# Altium schematic sheet PLC-无线通讯版-检测板-V1.SchDoc
size A0
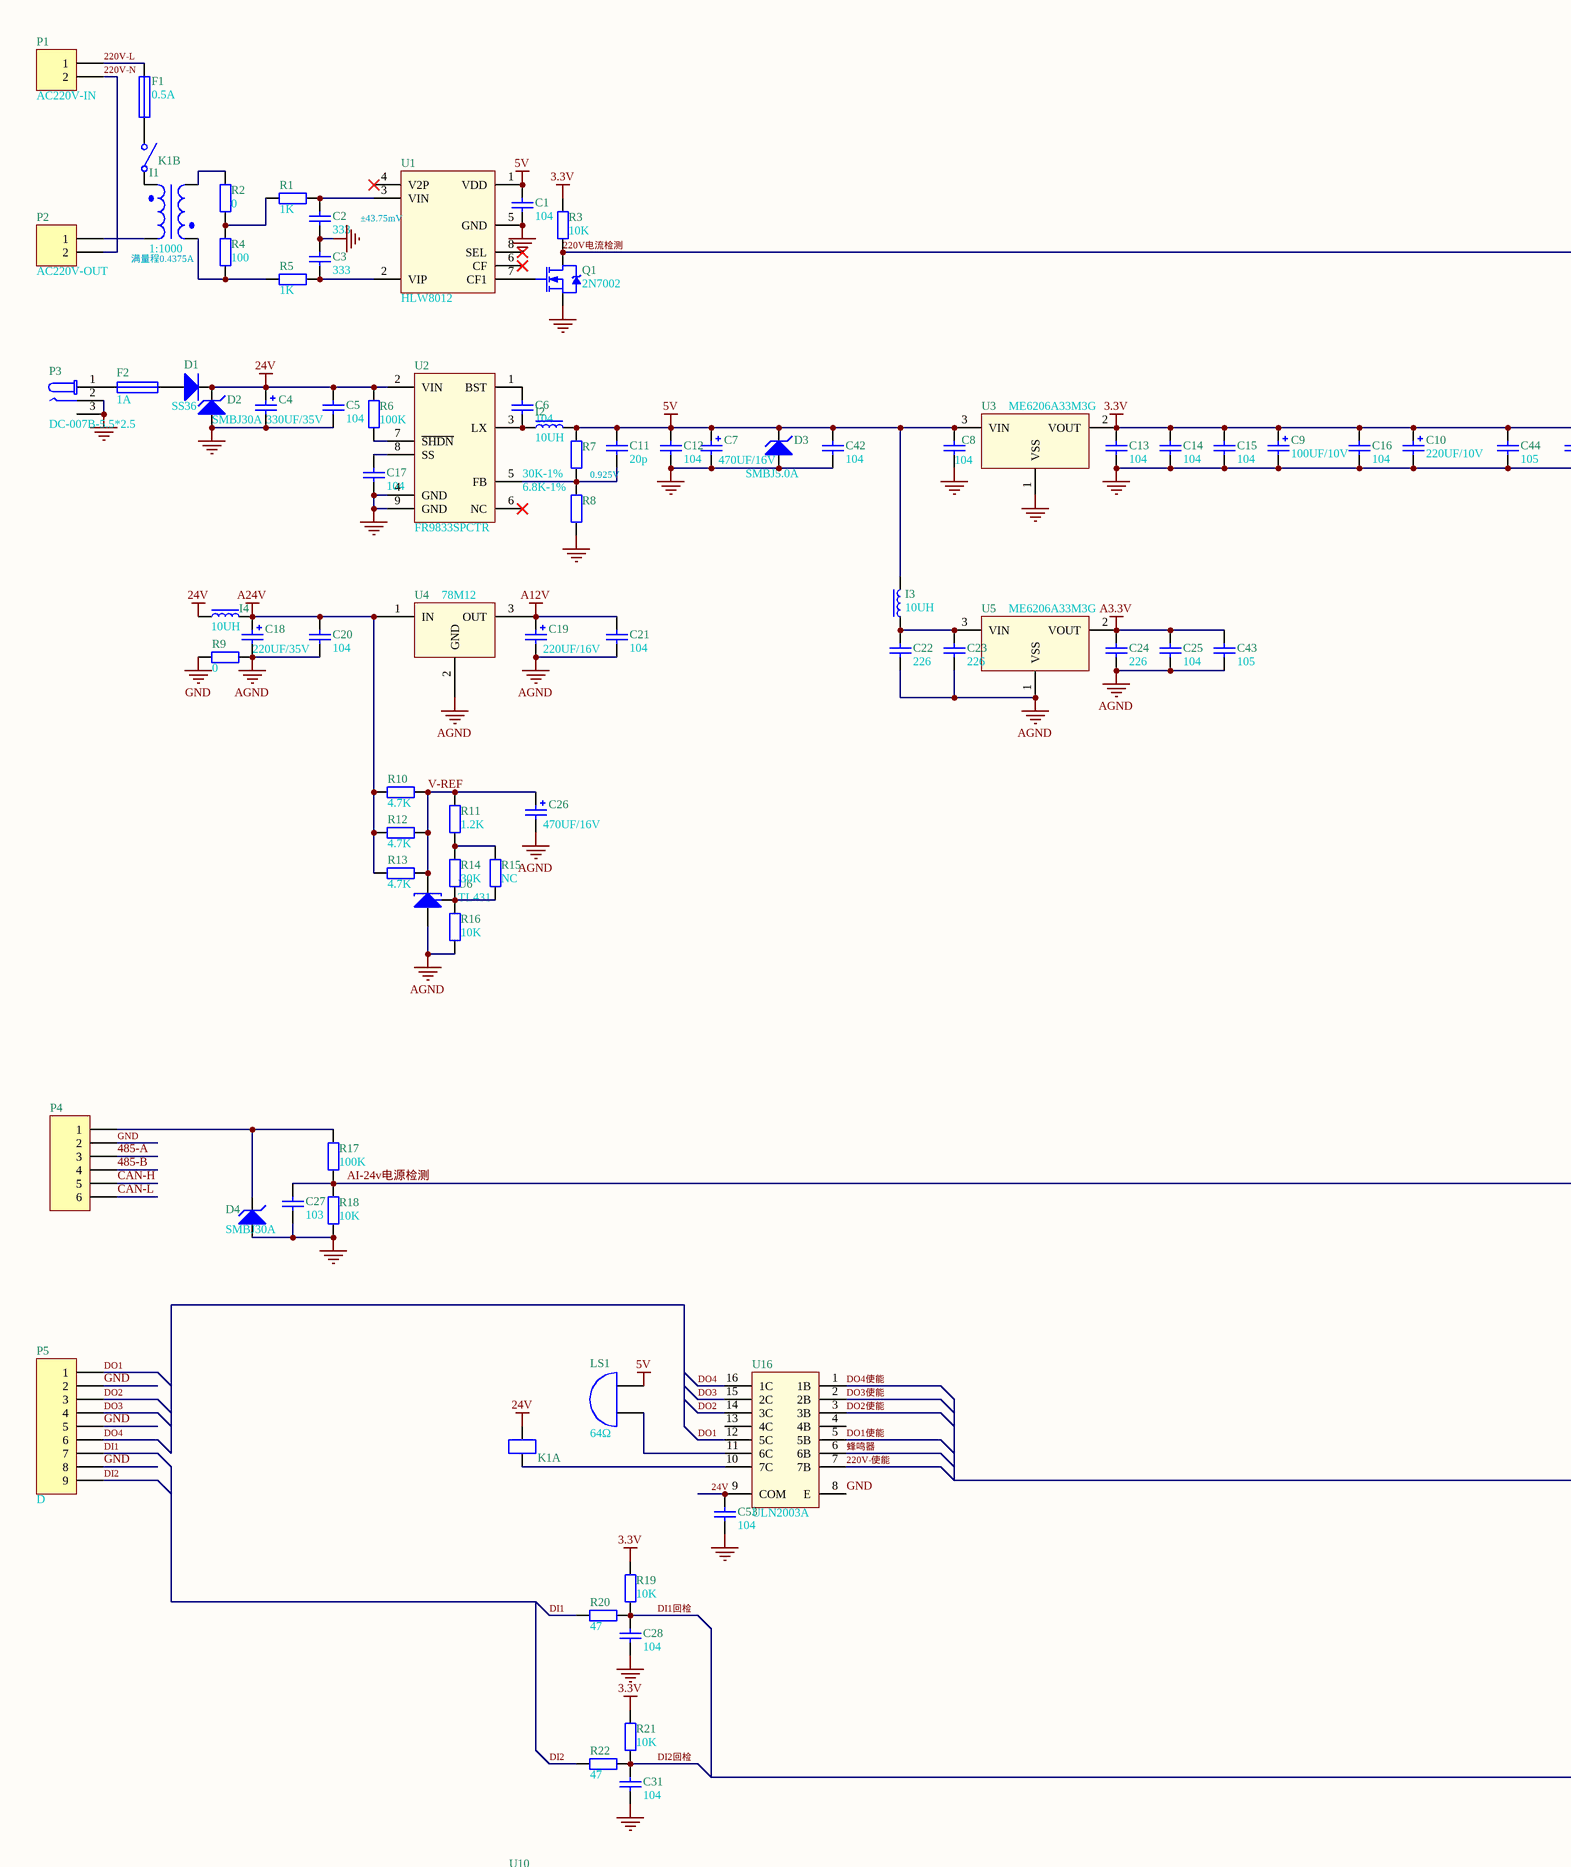
[diagram p0: PLC-无线通讯版-检测板-V1.SchDoc, top left]
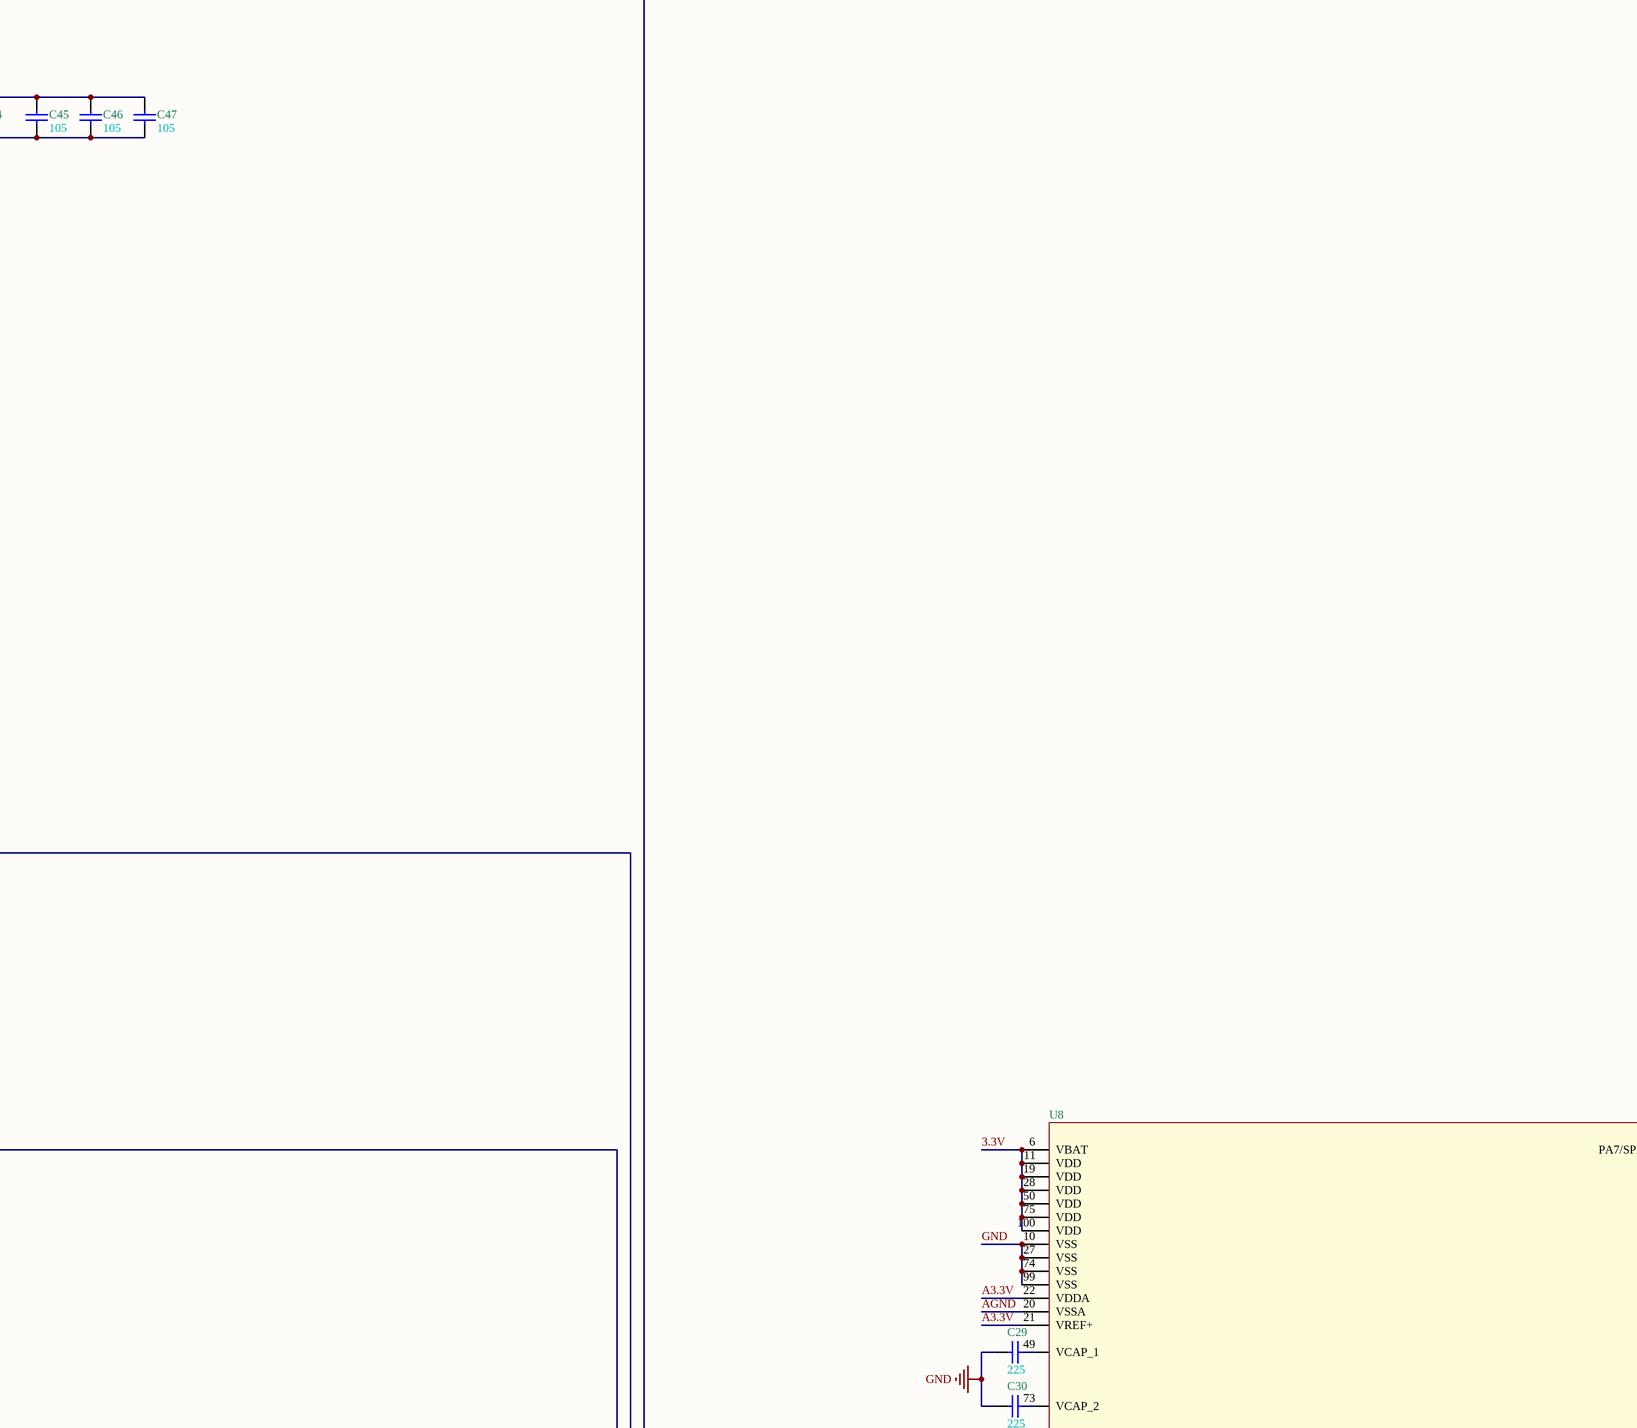
[diagram p1: PLC-无线通讯版-检测板-V1.SchDoc, top middle]
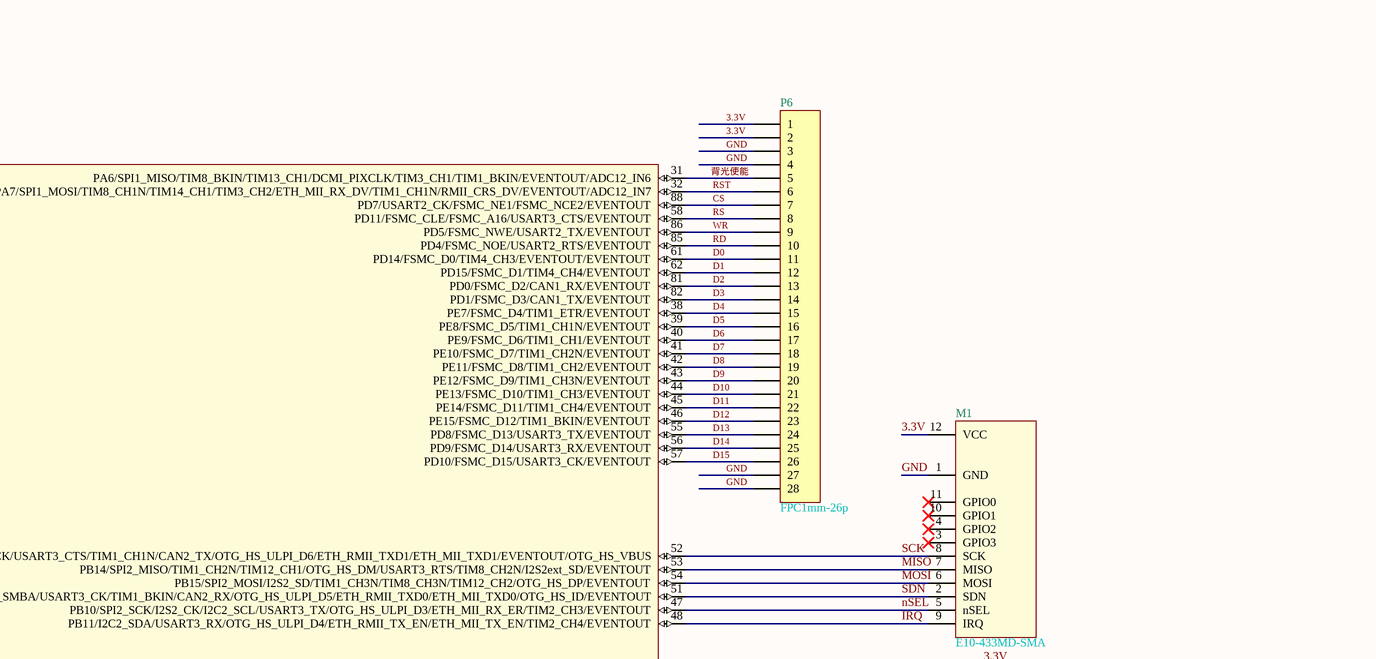
[diagram p2: PLC-无线通讯版-检测板-V1.SchDoc, top right]
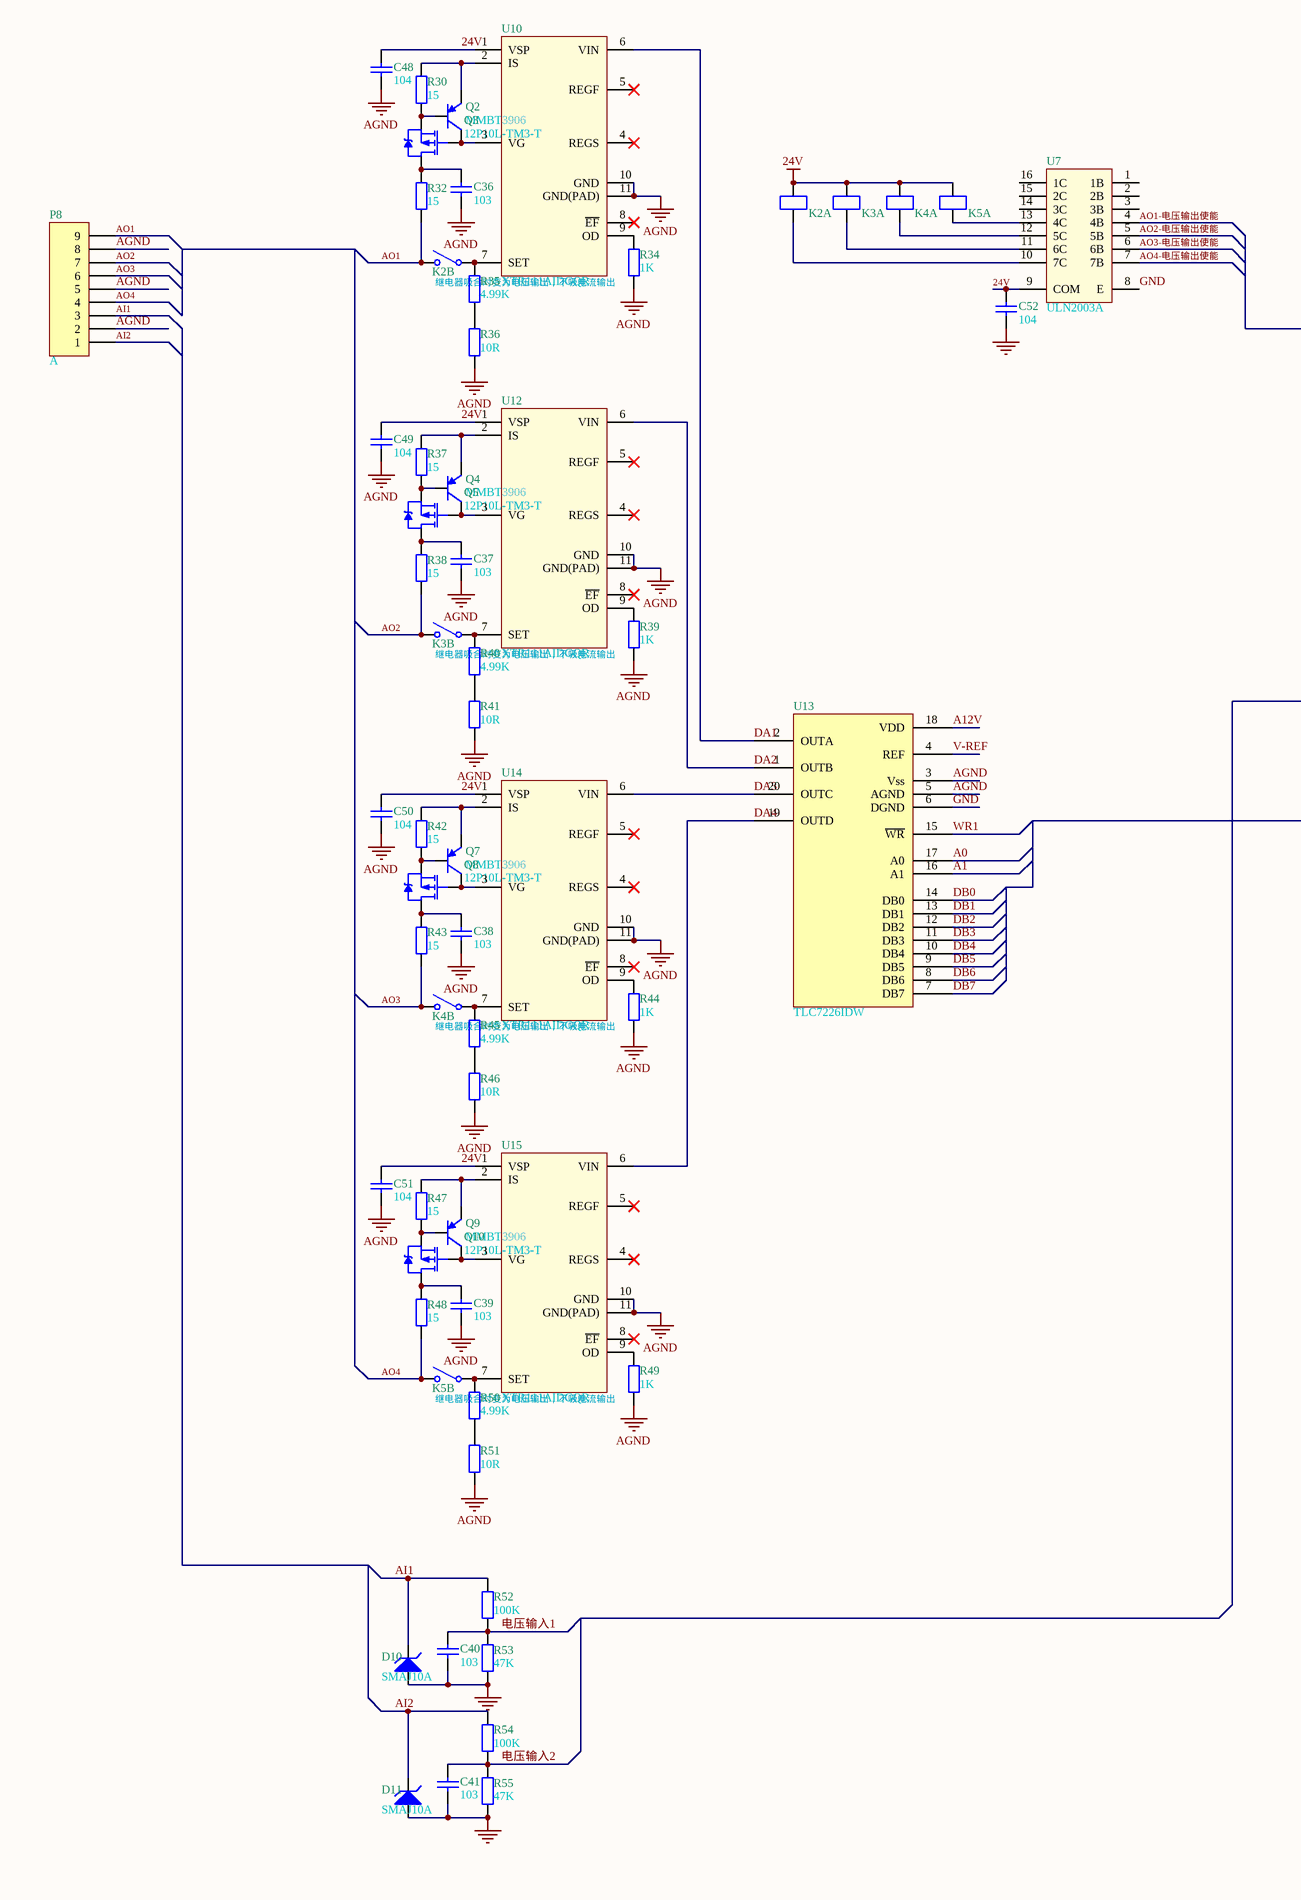
[diagram p3: PLC-无线通讯版-检测板-V1.SchDoc, bottom left]
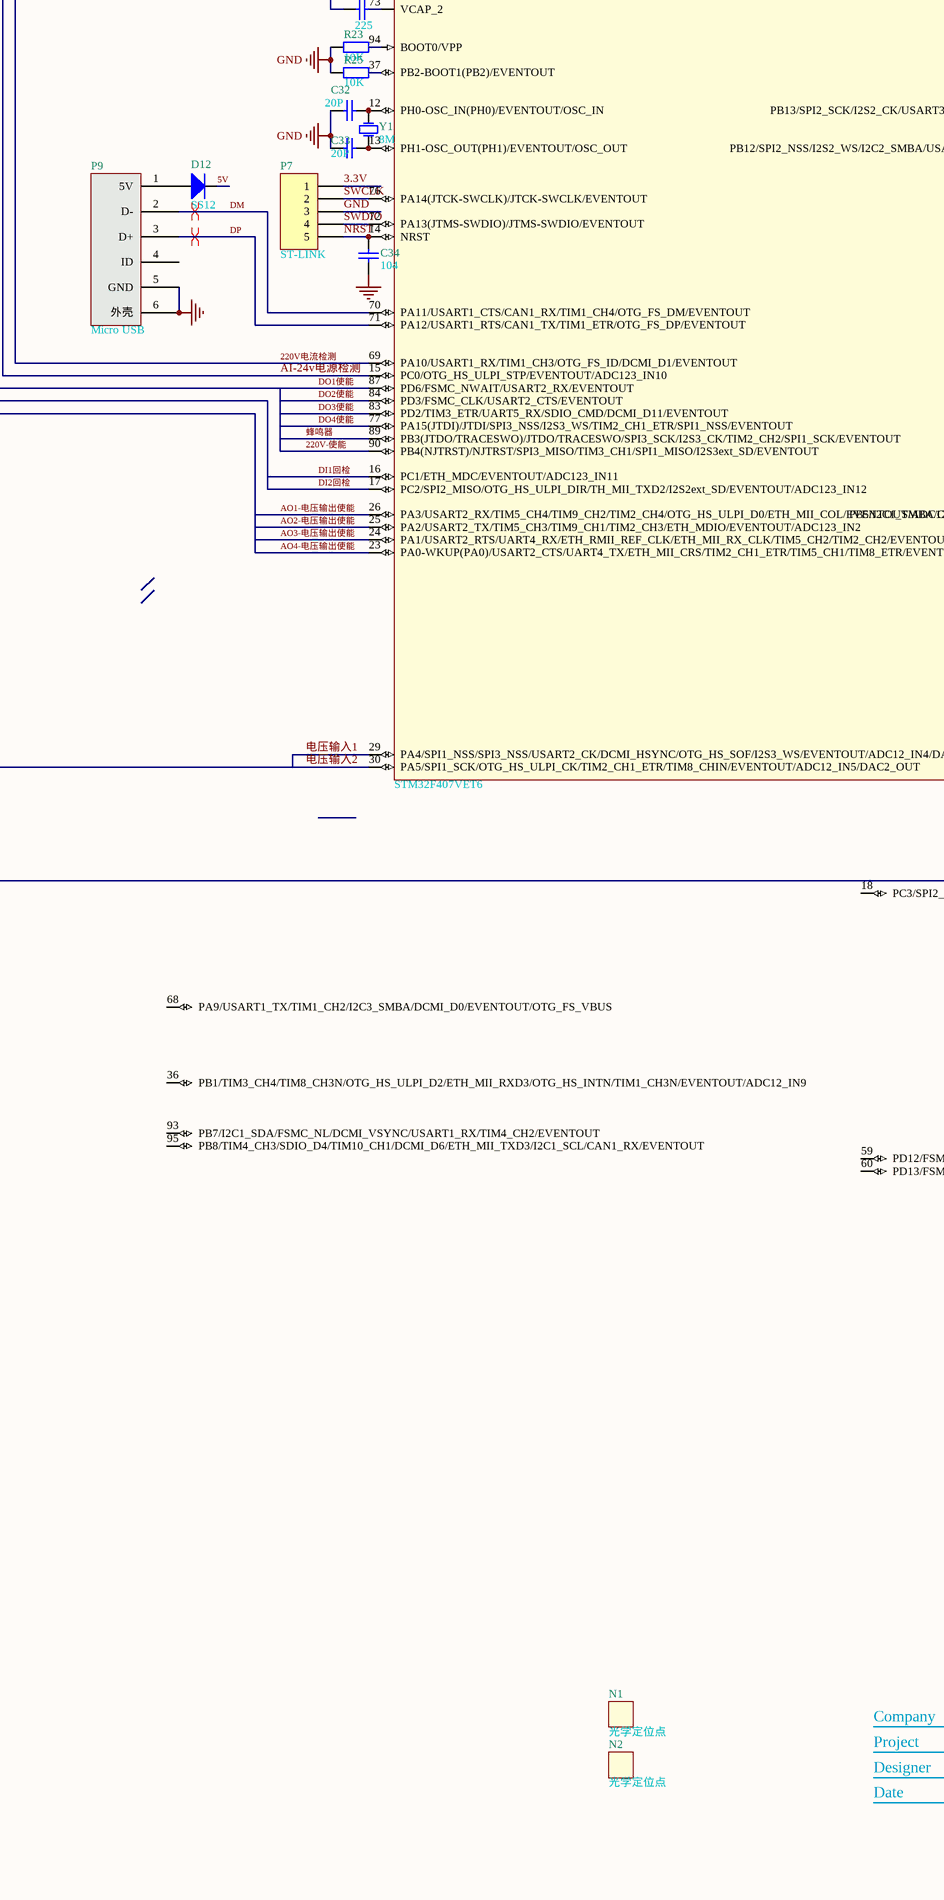
[diagram p4: PLC-无线通讯版-检测板-V1.SchDoc, bottom middle]
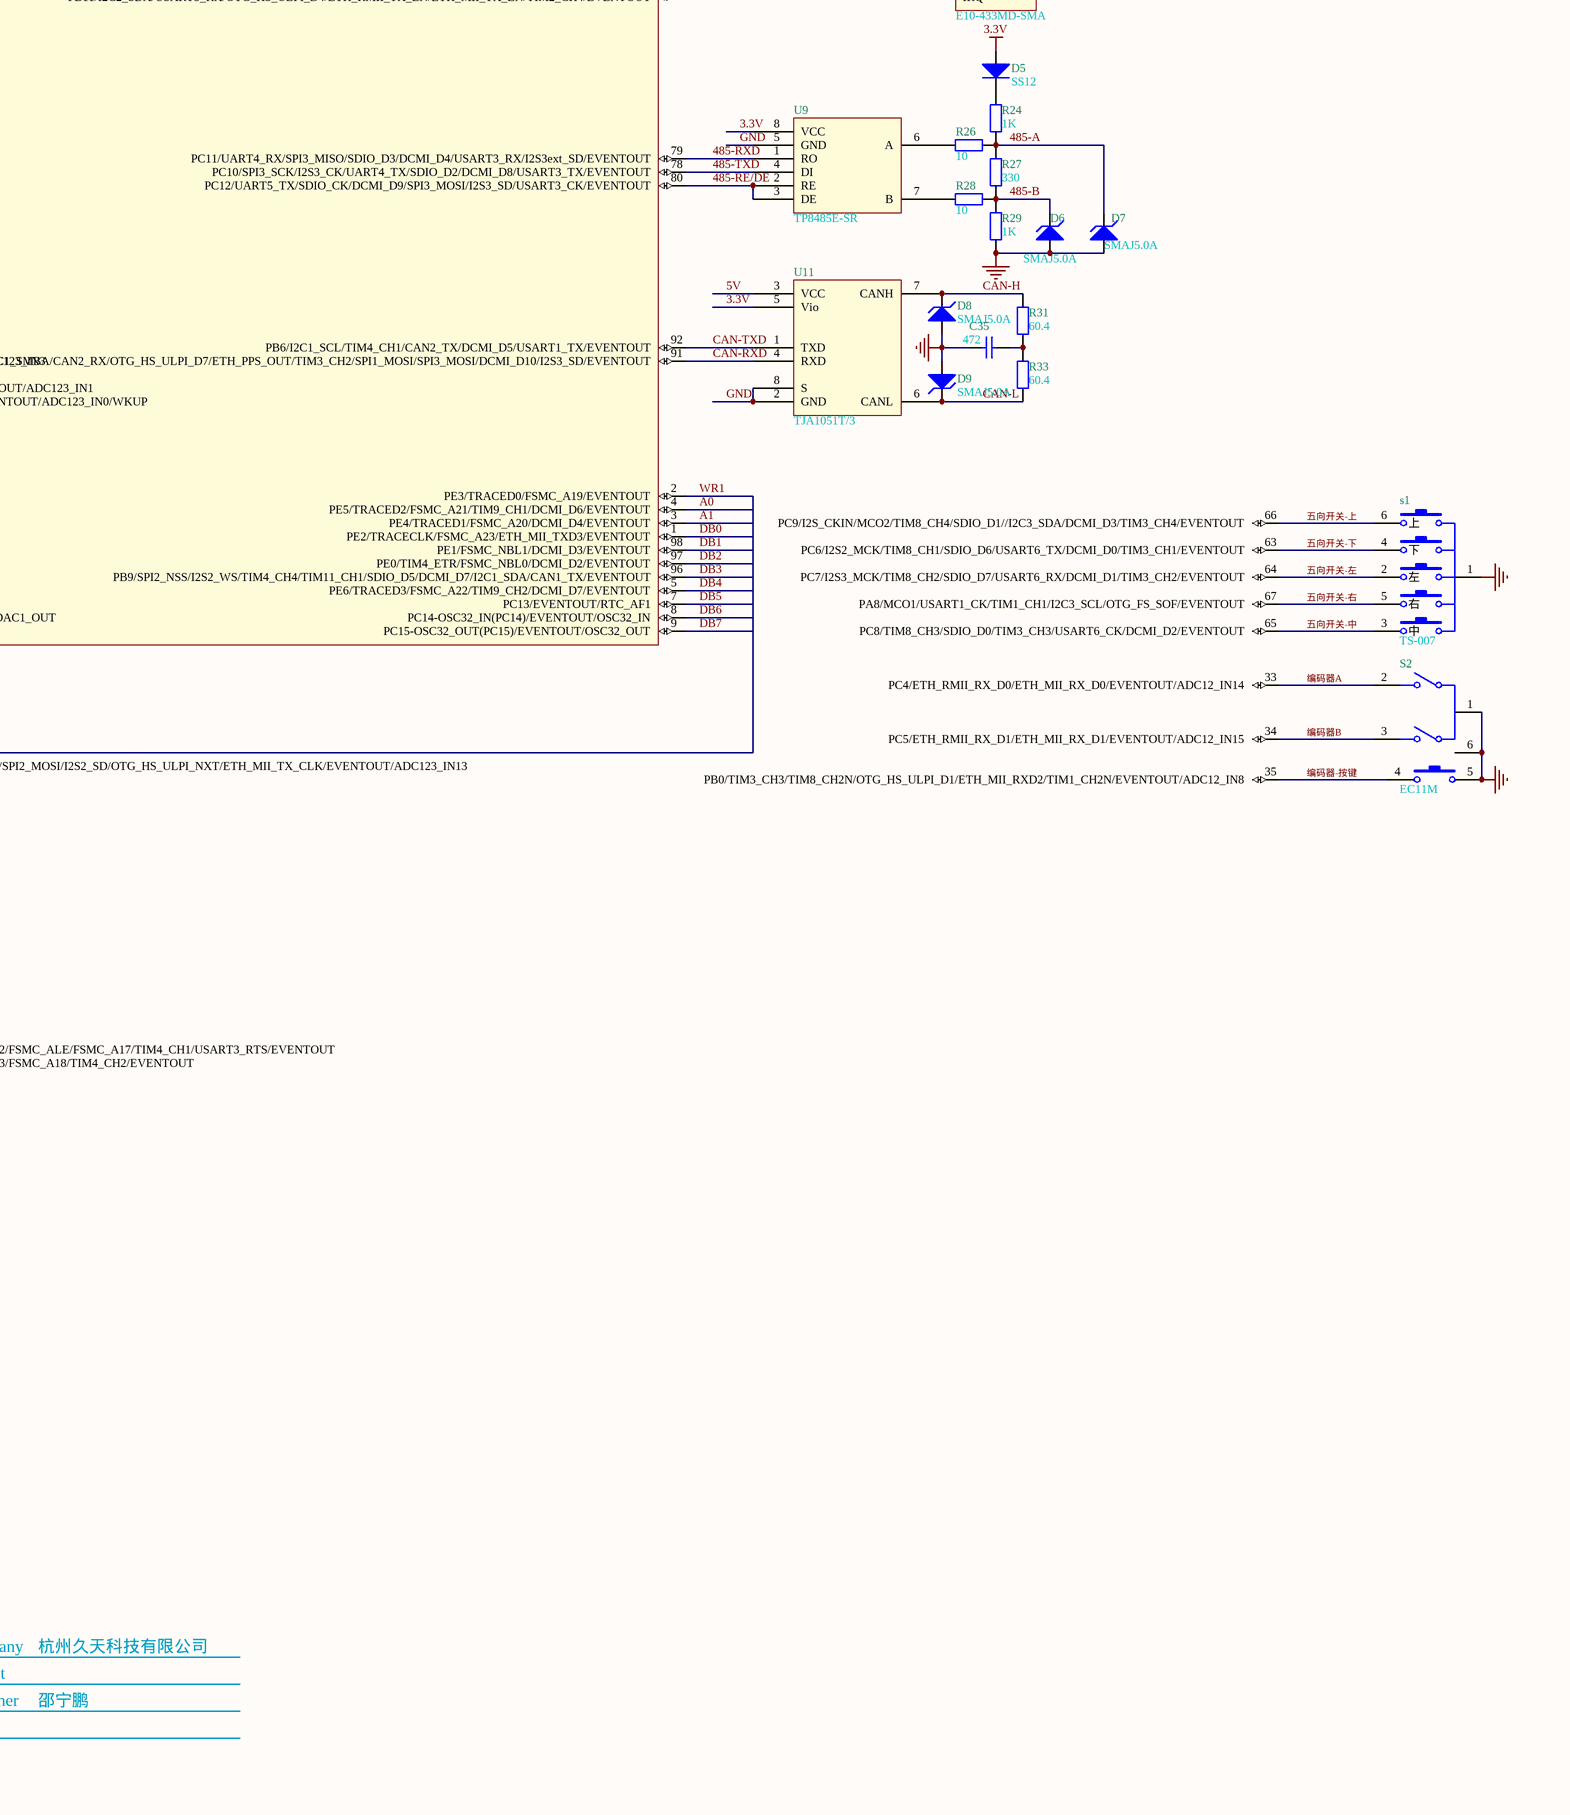
[diagram p5: PLC-无线通讯版-检测板-V1.SchDoc, bottom right]

## Parts
C1  104  [C-0603]
C2  333  [C-0603]
C3  333  [C-0603]
C4  330UF/35V  [贴片固态电容8*10-M]
C5  104  [C-0603]
C6  104  [C-0603]
C7  470UF/16V  [贴片固态电容8*10-M]
C8  104  [C-0603]
C9  100UF/10V  [贴片固态电容5*5.3]
C10  220UF/10V  [贴片固态电容6.3*5.3-M]
C11  20p  [C-0603]
C12  104  [C-0603]
C13  104  [C-0603]
C14  104  [C-0603]
C15  104  [C-0603]
C16  104  [C-0603]
C17  104  [C-0603]
C18  220UF/35V  [贴片固态电容8*10-M]
C19  220UF/16V  [贴片固态电容6.3*7.7]
C20  104  [C-0603]
C21  104  [C-0603]
C22  226  [C-0805]
C23  226  [C-0805]
C24  226  [C-0805]
C25  104  [C-0603]
C26  470UF/16V  [贴片固态电容8*10-M]
C27  103  [C-0603]
C28  104  [C-0603]
C29  225  [C-0603]
C30  225  [C-0603]
C31  104  [C-0603]
C32  20P  [C-0603]
C33  20P  [C-0603]
C34  104  [C-0603]
C35  472  [C-0603]
C36  103  [C-0603]
C37  103  [C-0603]
C38  103  [C-0603]
C39  103  [C-0603]
C40  103  [C-0603]
C41  103  [C-0603]
C42  104  [C-0603]
C43  105  [C-0603]
C44  105  [C-0603]
C45  105  [C-0603]
C46  105  [C-0603]
C47  105  [C-0603]
C48  104  [C-0603]
C49  104  [C-0603]
C50  104  [C-0603]
C51  104  [C-0603]
C52  104  [C-0603]
C53  104  [C-0603]
D1  SS36  [SMB]
D2  SMBJ30A  [SMB-N]
D3  SMBJ5.0A  [SMB-N]
D4  SMBJ30A  [SMB]
D5  SS12  [SOD-523/0603]
D6  SMAJ5.0A  [SMA]
D7  SMAJ5.0A  [SMA]
D8  SMAJ5.0A  [SMA]
D9  SMAJ5.0A  [SMA]
D10  SMAJ10A  [SMA]
D11  SMAJ10A  [SMA]
D12  SS12  [SMA]
F1  0.5A  [FUSE-3*10带引线]
F2  1A  [FUSE-1808保险丝座]
I1  1:1000  [EI19*6.5电流互感器]
I2  10UH  [一体成型电感0630]
I3  10UH  [SWPA4030S]
I4  10UH  [SWPA4030S]
K1  HF49FD-D24-1H11  [HF49FD-D24-1H11]  (value not drawn)  (parts A,B of 2)
K2  HF49FD-D24-1H11  [HF49FD-D24-1H11]  (value not drawn)  (parts A,B of 2)
K3  HF49FD-D24-1H11  [HF49FD-D24-1H11]  (value not drawn)  (parts A,B of 2)
K4  HF49FD-D24-1H11  [HF49FD-D24-1H11]  (value not drawn)  (parts A,B of 2)
K5  HF49FD-D24-1H11  [HF49FD-D24-1H11]  (value not drawn)  (parts A,B of 2)
LS1  64Ω  [蜂鸣器 无源 12*8.2]
M1  E10-433MD-SMA  [E10-433MD-SMA]
N1  光学定位点  [MARK-1mm-3mm]
N2  光学定位点  [MARK-1mm-3mm]
P1  AC220V-IN  [KF2EDGVC-5.08-2P]
P2  AC220V-OUT  [KF2EDGVC-5.08-2P]
P3  DC-007B-5.5*2.5  [DC-007B]
P4  (no value)  [2EMGKG-5.08-6P]
P5  D  [2EMGKG-5.08-9P]
P6  FPC1mm-26p  [FPC-0.5mm_26P下接翻盖]
P7  ST-LINK  [HDR1X5]
P8  A  [2EMGKG-5.08-9P]
P9  Micro USB  [MICRO-USB-牛角插板-无卷边]
Q1  2N7002  [SOT-23]
Q2  MMBT3906  [SOT-23]
Q3  12P10L-TM3-T  [TO-251-N]
Q4  MMBT3906  [SOT-23]
Q5  12P10L-TM3-T  [TO-251-N]
Q7  MMBT3906  [SOT-23]
Q8  12P10L-TM3-T  [TO-251-N]
Q9  MMBT3906  [SOT-23]
Q10  12P10L-TM3-T  [TO-251-N]
R1  1K  [R-0603]
R2  0  [R-1206]
R3  10K  [R-0603]
R4  100  [R-1206]
R5  1K  [R-0603]
R6  100K  [R-0603]
R7  30K-1%  [R-0603]
R8  6.8K-1%  [R-0603]
R9  0  [R-1206]
R10  4.7K  [R-1206]
R11  1.2K  [R-0603]
R12  4.7K  [R-1206]
R13  4.7K  [R-1206]
R14  30K  [R-0603]
R15  NC  [R-0603]
R16  10K  [R-0603]
R17  100K  [R-1206]
R18  10K  [R-1206]
R19  10K  [R-0603]
R20  47  [R-0603]
R21  10K  [R-0603]
R22  47  [R-0603]
R23  10K  [R-0603]
R24  1K  [R-0603]
R25  10K  [R-0603]
R26  10  [R-0805]
R27  330  [R-1206-M]
R28  10  [R-0805]
R29  1K  [R-0603]
R30  15  [R-0805]
R31  60.4  [R-1206]
R32  15  [R-0805]
R33  60.4  [R-1206]
R34  1K  [R-0603]
R35  4.99K  [R-0603]
R36  10R  [R-0603]
R37  15  [R-0805]
R38  15  [R-0805]
R39  1K  [R-0603]
R40  4.99K  [R-0603]
R41  10R  [R-0603]
R42  15  [R-0805]
R43  15  [R-0805]
R44  1K  [R-0603]
R45  4.99K  [R-0603]
R46  10R  [R-0603]
R47  15  [R-0805]
R48  15  [R-0805]
R49  1K  [R-0603]
R50  4.99K  [R-0603]
R51  10R  [R-0603]
R52  100K  [R-1206]
R53  47K  [R-1206]
R54  100K  [R-1206]
R55  47K  [R-1206]
s1  TS-007  [TS-007]
S2  EC11M  [EC11M]
U1  HLW8012  [SOP-8-M]
U2  FR9833SPCTR  [SOP-8-EXPOSED PAD]
U3  ME6206A33M3G  [SOT-23]
U4  78M12  [TO-252]
U5  ME6206A33M3G  [SOT-23]
U6  TL431  [SOT-23]
U7  ULN2003A  [SOP-16-M]
U8  STM32F407VET6  [LQFP100-N]
U9  TP8485E-SR  [SOP-8-N]
U10  XTR111AIDGQR  [MSOP-10(11)-M]
U11  TJA1051T/3  [SOP-8-N]
U12  XTR111AIDGQR  [MSOP-10(11)-M]
U13  TLC7226IDW  [SOP-20]
U14  XTR111AIDGQR  [MSOP-10(11)-M]
U15  XTR111AIDGQR  [MSOP-10(11)-M]
U16  ULN2003A  [SOP-16-M]
Y1  8M  [HC-49SMD]

## Nets
3.3V: C9.1 C10.1 C13.2 C14.2 C15.2 C16.2 C44.2 C45.2 C46.2 C47.2 D5.1(A) M1.12(VCC) P6.1 P6.2 P7.1 R3.2 R19.2 R21.2 U3.2(VOUT) U8.6(VBAT) U8.11(VDD) U8.19(VDD) U8.28(VDD) U8.50(VDD) U8.75(VDD) U8.100(VDD) U9.8(VCC) U11.5(Vio)
5V: C1.2 C7.1 C8.2 C11.2 C12.2 C42.2 D3.2(K) D12.2(K) I2.2 I3.2 LS1.1(A) R7.1 U1.1(VDD) U3.3(VIN) U11.3(VCC)
24V: C4.1 C5.2 C48.2 C49.2 C50.2 C51.2 C52.2 C53.2 D1.2(K) D2.2(K) I4.1 K1.2 K2.1 K3.1 K4.1 K5.1 R6.1 U2.2(VIN) U7.9(COM) U10.1(VSP) U12.1(VSP) U14.1(VSP) U15.1(VSP) U16.9(COM)
A3.3V: C24.2 C25.2 C43.2 U5.2(VOUT) U8.21(VREF+) U8.22(VDDA)
A12V: C19.1 C21.2 U4.3(OUT) U13.18(VDD)
A24V: C18.1 C20.2 I4.2 R10.2 R12.2 R13.2 U4.1(IN)
AGND: C18.2 C19.2 C20.1 C21.1 C22.1 C23.1 C24.1 C25.1 C26.2 C36.1 C37.1 C38.1 C39.1 C40.1 C41.1 C43.1 C48.1 C49.1 C50.1 C51.1 D10.1(A) D11.1(A) P8.2 P8.5 P8.8 R9.2 R16.1 R34.2 R36.2 R39.2 R41.2 R44.2 R46.2 R49.2 R51.2 R53.1 R55.1 U4.2(GND) U5.1(VSS) U6.3(A) U8.20(VSSA) U10.10(GND) U10.11(GND(PAD)) U12.10(GND) U12.11(GND(PAD)) U13.3(Vss) U13.5(AGND) U14.10(GND) U14.11(GND(PAD)) U15.10(GND) U15.11(GND(PAD))
GND: C1.1 C2.1 C3.2 C4.2 C5.1 C7.2 C8.1 C9.2 C10.2 C12.1 C13.1 C14.1 C15.1 C16.1 C17.1 C27.1 C28.1 C29.1 C30.1 C31.1 C32.1 C33.1 C34.1 C35.1 C42.1 C44.1 C45.1 C46.1 C47.1 C52.1 C53.1 D2.1(A) D3.1(A) D4.1(A) D6.1(A) D7.1(A) D8.1(A) D9.1(A) M1.1(GND) P3.2 P3.3(NC) P4.2 P5.2 P5.5 P5.8 P6.3 P6.4 P6.27 P6.28 P7.3 P9.5(GND) P9.6(外壳) Q1.2(S) R8.2 R9.1 R18.1 R23.2 R25.2 R29.1 s1.1(Common) S2.1 S2.5 S2.6 U1.5(GND) U2.4(GND) U2.9(GND) U3.1(VSS) U7.8(E) U8.10(VSS) U8.27(VSS) U8.74(VSS) U8.99(VSS) U9.5(GND) U11.2(GND) U11.8(S) U13.6(DGND) U16.8(E)
220V-L: F1.1 P1.1
220V-N: P1.2 P2.2
220V-使能: U8.90(PB4(NJTRST)/NJTRST/SPI3_MISO/TIM3_CH1/SPI1_MISO/I2S3ext_SD/EVENTOUT) U16.7(7B)
220V电流检测: Q1.3(D) R3.1 U8.69(PA10/USART1_RX/TIM1_CH3/OTG_FS_ID/DCMI_D1/EVENTOUT)
485-A: D7.2(K) P4.3 R24.2 R26.1 R27.2
485-B: D6.2(K) P4.4 R27.1 R28.1 R29.2
485-RE/DE: U8.80(PC12/UART5_TX/SDIO_CK/DCMI_D9/SPI3_MOSI/I2S3_SD/USART3_CK/EVENTOUT) U9.2(RE) U9.3(DE)
485-RXD: U8.79(PC11/UART4_RX/SPI3_MISO/SDIO_D3/DCMI_D4/USART3_RX/I2S3ext_SD/EVENTOUT) U9.1(RO)
485-TXD: U8.78(PC10/SPI3_SCK/I2S3_CK/UART4_TX/SDIO_D2/DCMI_D8/USART3_TX/EVENTOUT) U9.4(DI)
A0: U8.4(PE5/TRACED2/FSMC_A21/TIM9_CH1/DCMI_D6/EVENTOUT) U13.17(A0)
A1: U8.3(PE4/TRACED1/FSMC_A20/DCMI_D4/EVENTOUT) U13.16(A1)
AI1: D10.2(K) P8.3 R52.2
AI2: D11.2(K) P8.1 R54.2
AI-24v电源检测: C27.2 R17.1 R18.2 U8.15(PC0/OTG_HS_ULPI_STP/EVENTOUT/ADC123_IN10)
AO1: K2.4 P8.9 R32.2
AO1-电压输出使能: U7.4(4B) U8.26(PA3/USART2_RX/TIM5_CH4/TIM9_CH2/TIM2_CH4/OTG_HS_ULPI_D0/ETH_MII_COL/EVENTOUT/ADC123_IN3)
AO2: K3.4 P8.7 R38.2
AO2-电压输出使能: U7.5(5B) U8.25(PA2/USART2_TX/TIM5_CH3/TIM9_CH1/TIM2_CH3/ETH_MDIO/EVENTOUT/ADC123_IN2)
AO3: K4.4 P8.6 R43.2
AO3-电压输出使能: U7.6(6B) U8.24(PA1/USART2_RTS/UART4_RX/ETH_RMII_REF_CLK/ETH_MII_RX_CLK/TIM5_CH2/TIM2_CH2/EVENTOUT/ADC123_IN1)
AO4: K5.4 P8.4 R48.2
AO4-电压输出使能: U7.7(7B) U8.23(PA0-WKUP(PA0)/USART2_CTS/UART4_TX/ETH_MII_CRS/TIM2_CH1_ETR/TIM5_CH1/TIM8_ETR/EVENTOUT/ADC123_IN0/WKUP)
CAN-H: D8.2(K) P4.5 R31.2 U11.7(CANH)
CAN-L: D9.2(K) P4.6 R33.1 U11.6(CANL)
CAN-RXD: U8.91(PB5/I2C1_SMBA/CAN2_RX/OTG_HS_ULPI_D7/ETH_PPS_OUT/TIM3_CH2/SPI1_MOSI/SPI3_MOSI/DCMI_D10/I2S3_SD/EVENTOUT) U11.4(RXD)
CAN-TXD: U8.92(PB6/I2C1_SCL/TIM4_CH1/CAN2_TX/DCMI_D5/USART1_TX/EVENTOUT) U11.1(TXD)
CS: P6.7 U8.88(PD7/USART2_CK/FSMC_NE1/FSMC_NCE2/EVENTOUT)
D0: P6.11 U8.61(PD14/FSMC_D0/TIM4_CH3/EVENTOUT/EVENTOUT)
D1: P6.12 U8.62(PD15/FSMC_D1/TIM4_CH4/EVENTOUT)
D2: P6.13 U8.81(PD0/FSMC_D2/CAN1_RX/EVENTOUT)
D3: P6.14 U8.82(PD1/FSMC_D3/CAN1_TX/EVENTOUT)
D4: P6.15 U8.38(PE7/FSMC_D4/TIM1_ETR/EVENTOUT)
D5: P6.16 U8.39(PE8/FSMC_D5/TIM1_CH1N/EVENTOUT)
D6: P6.17 U8.40(PE9/FSMC_D6/TIM1_CH1/EVENTOUT)
D7: P6.18 U8.41(PE10/FSMC_D7/TIM1_CH2N/EVENTOUT)
D8: P6.19 U8.42(PE11/FSMC_D8/TIM1_CH2/EVENTOUT)
D9: P6.20 U8.43(PE12/FSMC_D9/TIM1_CH3N/EVENTOUT)
D10: P6.21 U8.44(PE13/FSMC_D10/TIM1_CH3/EVENTOUT)
D11: P6.22 U8.45(PE14/FSMC_D11/TIM1_CH4/EVENTOUT)
D12: P6.23 U8.46(PE15/FSMC_D12/TIM1_BKIN/EVENTOUT)
D13: P6.24 U8.55(PD8/FSMC_D13/USART3_TX/EVENTOUT)
D14: P6.25 U8.56(PD9/FSMC_D14/USART3_RX/EVENTOUT)
D15: P6.26 U8.57(PD10/FSMC_D15/USART3_CK/EVENTOUT)
DA1: U10.6(VIN) U13.2(OUTA)
DA2: U12.6(VIN) U13.1(OUTB)
DA3: U13.20(OUTC) U14.6(VIN)
DA4: U13.19(OUTD) U15.6(VIN)
DB0: U8.1(PE2/TRACECLK/FSMC_A23/ETH_MII_TXD3/EVENTOUT) U13.14(DB0)
DB1: U8.98(PE1/FSMC_NBL1/DCMI_D3/EVENTOUT) U13.13(DB1)
DB2: U8.97(PE0/TIM4_ETR/FSMC_NBL0/DCMI_D2/EVENTOUT) U13.12(DB2)
DB3: U8.96(PB9/SPI2_NSS/I2S2_WS/TIM4_CH4/TIM11_CH1/SDIO_D5/DCMI_D7/I2C1_SDA/CAN1_TX/EVENTOUT) U13.11(DB3)
DB4: U8.5(PE6/TRACED3/FSMC_A22/TIM9_CH2/DCMI_D7/EVENTOUT) U13.10(DB4)
DB5: U8.7(PC13/EVENTOUT/RTC_AF1) U13.9(DB5)
DB6: U8.8(PC14-OSC32_IN(PC14)/EVENTOUT/OSC32_IN) U13.8(DB6)
DB7: U8.9(PC15-OSC32_OUT(PC15)/EVENTOUT/OSC32_OUT) U13.7(DB7)
DI1: P5.7 R20.2
DI1回检: C28.2 R19.1 R20.1 U8.16(PC1/ETH_MDC/EVENTOUT/ADC123_IN11)
DI2: P5.9 R22.2
DI2回检: C31.2 R21.1 R22.1 U8.17(PC2/SPI2_MISO/OTG_HS_ULPI_DIR/TH_MII_TXD2/I2S2ext_SD/EVENTOUT/ADC123_IN12)
DM: P9.2(D-) U8.70(PA11/USART1_CTS/CAN1_RX/TIM1_CH4/OTG_FS_DM/EVENTOUT)
DO1: P5.1 U16.12(5C)
DO1使能: U8.87(PD6/FSMC_NWAIT/USART2_RX/EVENTOUT) U16.5(5B)
DO2: P5.3 U16.14(3C)
DO2使能: U8.84(PD3/FSMC_CLK/USART2_CTS/EVENTOUT) U16.3(3B)
DO3: P5.4 U16.15(2C)
DO3使能: U8.83(PD2/TIM3_ETR/UART5_RX/SDIO_CMD/DCMI_D11/EVENTOUT) U16.2(2B)
DO4: P5.6 U16.16(1C)
DO4使能: U8.77(PA15(JTDI)/JTDI/SPI3_NSS/I2S3_WS/TIM2_CH1_ETR/SPI1_NSS/EVENTOUT) U16.1(1B)
DP: P9.3(D+) U8.71(PA12/USART1_RTS/CAN1_TX/TIM1_ETR/OTG_FS_DP/EVENTOUT)
IRQ: M1.9(IRQ) U8.48(PB11/I2C2_SDA/USART3_RX/OTG_HS_ULPI_D4/ETH_RMII_TX_EN/ETH_MII_TX_EN/TIM2_CH4/EVENTOUT)
MISO: M1.7(MISO) U8.53(PB14/SPI2_MISO/TIM1_CH2N/TIM12_CH1/OTG_HS_DM/USART3_RTS/TIM8_CH2N/I2S2ext_SD/EVENTOUT)
MOSI: M1.6(MOSI) U8.54(PB15/SPI2_MOSI/I2S2_SD/TIM1_CH3N/TIM8_CH3N/TIM12_CH2/OTG_HS_DP/EVENTOUT)
NRST: C34.2 P7.5 U8.14(NRST)
nSEL: M1.5(nSEL) U8.47(PB10/SPI2_SCK/I2S2_CK/I2C2_SCL/USART3_TX/OTG_HS_ULPI_D3/ETH_MII_RX_ER/TIM2_CH3/EVENTOUT)
RD: P6.10 U8.85(PD4/FSMC_NOE/USART2_RTS/EVENTOUT)
RS: P6.8 U8.58(PD11/FSMC_CLE/FSMC_A16/USART3_CTS/EVENTOUT)
RST: P6.6 U8.32(PA7/SPI1_MOSI/TIM8_CH1N/TIM14_CH1/TIM3_CH2/ETH_MII_RX_DV/TIM1_CH1N/RMII_CRS_DV/EVENTOUT/ADC12_IN7)
SCK: M1.8(SCK) U8.52(PB13/SPI2_SCK/I2S2_CK/USART3_CTS/TIM1_CH1N/CAN2_TX/OTG_HS_ULPI_D6/ETH_RMII_TXD1/ETH_MII_TXD1/EVENTOUT/OTG_HS_VBUS)
SDN: M1.2(SDN) U8.51(PB12/SPI2_NSS/I2S2_WS/I2C2_SMBA/USART3_CK/TIM1_BKIN/CAN2_RX/OTG_HS_ULPI_D5/ETH_RMII_TXD0/ETH_MII_TXD0/OTG_HS_ID/EVENTOUT)
SWCLK: P7.2 U8.76(PA14(JTCK-SWCLK)/JTCK-SWCLK/EVENTOUT)
SWDIO: P7.4 U8.72(PA13(JTMS-SWDIO)/JTMS-SWDIO/EVENTOUT)
V-REF: C26.1 R10.1 R11.2 R12.1 R13.1 U6.2(K) U13.4(REF)
WR: P6.9 U8.86(PD5/FSMC_NWE/USART2_TX/EVENTOUT)
WR1: U8.2(PE3/TRACED0/FSMC_A19/EVENTOUT) U13.15(~{WR})
五向开关-上: s1.6(上) U8.66(PC9/I2S_CKIN/MCO2/TIM8_CH4/SDIO_D1//I2C3_SDA/DCMI_D3/TIM3_CH4/EVENTOUT)
五向开关-下: s1.4(下) U8.63(PC6/I2S2_MCK/TIM8_CH1/SDIO_D6/USART6_TX/DCMI_D0/TIM3_CH1/EVENTOUT)
五向开关-中: s1.3(中) U8.65(PC8/TIM8_CH3/SDIO_D0/TIM3_CH3/USART6_CK/DCMI_D2/EVENTOUT)
五向开关-右: s1.5(右) U8.67(PA8/MCO1/USART1_CK/TIM1_CH1/I2C3_SCL/OTG_FS_SOF/EVENTOUT)
五向开关-左: s1.2(左) U8.64(PC7/I2S3_MCK/TIM8_CH2/SDIO_D7/USART6_RX/DCMI_D1/TIM3_CH2/EVENTOUT)
电压输入1: C40.2 R52.1 R53.2 U8.29(PA4/SPI1_NSS/SPI3_NSS/USART2_CK/DCMI_HSYNC/OTG_HS_SOF/I2S3_WS/EVENTOUT/ADC12_IN4/DAC1_OUT)
电压输入2: C41.2 R54.1 R55.2 U8.30(PA5/SPI1_SCK/OTG_HS_ULPI_CK/TIM2_CH1_ETR/TIM8_CHIN/EVENTOUT/ADC12_IN5/DAC2_OUT)
编码器-按键: S2.4 U8.35(PB0/TIM3_CH3/TIM8_CH2N/OTG_HS_ULPI_D1/ETH_MII_RXD2/TIM1_CH2N/EVENTOUT/ADC12_IN8)
编码器A: S2.2 U8.33(PC4/ETH_RMII_RX_D0/ETH_MII_RX_D0/EVENTOUT/ADC12_IN14)
编码器B: S2.3 U8.34(PC5/ETH_RMII_RX_D1/ETH_MII_RX_D1/EVENTOUT/ADC12_IN15)
背光使能: P6.5 U8.31(PA6/SPI1_MISO/TIM8_BKIN/TIM13_CH1/DCMI_PIXCLK/TIM3_CH1/TIM1_BKIN/EVENTOUT/ADC12_IN6)
蜂鸣器: U8.89(PB3(JTDO/TRACESWO)/JTDO/TRACESWO/SPI3_SCK/I2S3_CK/TIM2_CH2/SPI1_SCK/EVENTOUT) U16.6(6B)
NetC2_2: C2.2 R1.2 U1.3(VIN)
NetC3_1: C3.1 R5.2 U1.2(VIP)
NetC6_1: C6.1 I2.1 U2.3(LX)
NetC6_2: C6.2 U2.1(BST)
NetC11_1: C11.1 R7.2 R8.1 U2.5(FB)
NetC17_2: C17.2 U2.8(SS)
NetC22_2: C22.2 C23.2 I3.1 U5.3(VIN)
NetC29_2: C29.2 U8.49(VCAP_1)
NetC30_2: C30.2 U8.73(VCAP_2)
NetC32_2: C32.2 U8.12(PH0-OSC_IN(PH0)/EVENTOUT/OSC_IN) Y1.2(OSC2)
NetC33_2: C33.2 U8.13(PH1-OSC_OUT(PH1)/EVENTOUT/OSC_OUT) Y1.1(OSC1)
NetC35_2: C35.2 R31.1 R33.2
NetC36_2: C36.2 Q3.2(D) R32.1
NetC37_2: C37.2 Q5.2(D) R38.1
NetC38_2: C38.2 Q8.2(D) R43.1
NetC39_2: C39.2 Q10.2(D) R48.1
NetD1_1: D1.1(A) F2.2
NetD4_2: D4.2(K) P4.1 R17.2
NetD5_2: D5.2(K) R24.1
NetD12_1: D12.1(A) P9.1(5V)
NetF1_2: F1.2 K1.4
NetF2_1: F2.1 P3.1
NetI1_1: I1.1 K1.3
NetI1_2: I1.2 P2.1
NetI1_3: I1.3 R2.1
NetI1_4: I1.4 R4.2 R5.1
NetK1_1: K1.1 U16.10(7C)
NetK2_2: K2.2 U7.10(7C)
NetK2_3: K2.3 R35.1 U10.7(SET)
NetK3_2: K3.2 U7.11(6C)
NetK3_3: K3.3 R40.1 U12.7(SET)
NetK4_2: K4.2 U7.12(5C)
NetK4_3: K4.3 R45.1 U14.7(SET)
NetK5_2: K5.2 U7.13(4C)
NetK5_3: K5.3 R50.1 U15.7(SET)
NetLS1_2: LS1.2(B) U16.11(6C)
NetQ1_1: Q1.1(G) U1.7(CF1)
NetQ2_1: Q2.1(B) Q3.3(S) R30.2
NetQ2_2: Q2.2(E) R30.1 U10.2(IS)
NetQ2_3: Q2.3(C) Q3.1(G) U10.3(VG)
NetQ4_1: Q4.1(B) Q5.3(S) R37.2
NetQ4_2: Q4.2(E) R37.1 U12.2(IS)
NetQ4_3: Q4.3(C) Q5.1(G) U12.3(VG)
NetQ7_1: Q7.1(B) Q8.3(S) R42.2
NetQ7_2: Q7.2(E) R42.1 U14.2(IS)
NetQ7_3: Q7.3(C) Q8.1(G) U14.3(VG)
NetQ9_1: Q9.1(B) Q10.3(S) R47.2
NetQ9_2: Q9.2(E) R47.1 U15.2(IS)
NetQ9_3: Q9.3(C) Q10.1(G) U15.3(VG)
NetR1_1: R1.1 R2.2 R4.1
NetR6_2: R6.2 U2.7(~{SHDN})
NetR11_1: R11.1 R14.2 R15.2
NetR14_1: R14.1 R15.1 R16.2 U6.1(REF)
NetR23_1: R23.1 U8.94(BOOT0/VPP)
NetR25_1: R25.1 U8.37(PB2-BOOT1(PB2)/EVENTOUT)
NetR26_2: R26.2 U9.6(A)
NetR28_2: R28.2 U9.7(B)
NetR34_1: R34.1 U10.9(OD)
NetR35_2: R35.2 R36.1
NetR39_1: R39.1 U12.9(OD)
NetR40_2: R40.2 R41.1
NetR44_1: R44.1 U14.9(OD)
NetR45_2: R45.2 R46.1
NetR49_1: R49.1 U15.9(OD)
NetR50_2: R50.2 R51.1

Not connected (* = marked no-connect by the designer): M1 3(GPIO3)* 4(GPIO2)* 10(GPIO1)* 11(GPIO0)*; P9 4(ID); U1 4(V2P)* 6(CF)* 8(SEL)*; U2 6(NC)*; U7 1(1B) 2(2B) 3(3B) 14(3C) 15(2C) 16(1C); U8 18(PC3/SPI2_MOSI/I2S2_SD/OTG_HS_ULPI_NXT/ETH_MII_TX_CLK/EVENTOUT/ADC123_IN13) 36(PB1/TIM3_CH4/TIM8_CH3N/OTG_HS_ULPI_D2/ETH_MII_RXD3/OTG_HS_INTN/TIM1_CH3N/EVENTOUT/ADC12_IN9) 59(PD12/FSMC_ALE/FSMC_A17/TIM4_CH1/USART3_RTS/EVENTOUT) 60(PD13/FSMC_A18/TIM4_CH2/EVENTOUT) 68(PA9/USART1_TX/TIM1_CH2/I2C3_SMBA/DCMI_D0/EVENTOUT/OTG_FS_VBUS) 93(PB7/I2C1_SDA/FSMC_NL/DCMI_VSYNC/USART1_RX/TIM4_CH2/EVENTOUT) 95(PB8/TIM4_CH3/SDIO_D4/TIM10_CH1/DCMI_D6/ETH_MII_TXD3/I2C1_SCL/CAN1_RX/EVENTOUT); U10 4(REGS)* 5(REGF)* 8(~{EF})*; U12 4(REGS)* 5(REGF)* 8(~{EF})*; U14 4(REGS)* 5(REGF)* 8(~{EF})*; U15 4(REGS)* 5(REGF)* 8(~{EF})*; U16 4(4B) 13(4C)

## Layout directives
differential pair: DM, DP

## Notes on the sheet
- (near U1) ±43.75mV
- (near I1) 满量程0.4375A
- 0.925V
- (near K2) 继电器吸合时变为电压输出，不吸电流输出
- (near K3) 继电器吸合时变为电压输出，不吸电流输出
- (near K4) 继电器吸合时变为电压输出，不吸电流输出
- (near K5) 继电器吸合时变为电压输出，不吸电流输出
- Project
- Company
- 杭州久天科技有限公司
- Designer
- Date
- 邵宁鹏

## Library data of the parts
C1-C3 C5 C6 C8 C11-C17 C20-C25 C42-C53 = Cap: Capacitor; Published: 8-Jun-2000; LatestRevisionDate: 17-Jul-2002; LatestRevisionNote: Re-released for DXP Platform.; PackageReference: RAD-0.3; Publisher: Altium Limited
C4 C18 = Cap Pol1: 电解电容; Published: 8-Jun-2000; LatestRevisionDate: 17-Jul-2002; LatestRevisionNote: Re-released for DXP Platform.; PackageReference: RB7.6-15; Publisher: Altium Limited
C7 C9 C10 C19 C26 = Cap Pol1: Polarized Capacitor (Radial); Published: 8-Jun-2000; LatestRevisionDate: 17-Jul-2002; LatestRevisionNote: Re-released for DXP Platform.; PackageReference: RB7.6-15; Publisher: Altium Limited
C27-C41 = Cap-0603: 0805; Published: 8-Jun-2000; LatestRevisionDate: 17-Jul-2002; LatestRevisionNote: Re-released for DXP Platform.; PackageReference: RAD-0.3; Publisher: Altium Limited
D1 = SS36: SMB; Published: 8-Jun-2000; LatestRevisionDate: 17-Jul-2002; LatestRevisionNote: Re-released for DXP Platform.; DatasheetVersion: Aug-1984; PackageReference: DO-201AD; Publisher: Altium Limited; ComponentLink1Description: Manufacturer Link; ComponentLink1URL: http://www.irf.com/
D2-D4 D6-D11 = TVS-1: SMB
D5 D12 = SS14: SMA
F1 F2 = Fuse 1: Fuse; Published: 8-Jun-2000; LatestRevisionDate: 17-Jul-2002; LatestRevisionNote: Re-released for DXP Platform.; PackageReference: PIN-W2/E2.8; Publisher: Altium Limited
I1 = 电流互感器
I2-I4 = Inductance3
LS1 = Bell: Electrical Bell; Published: 24-Mar-1999; LatestRevisionDate: 17-Jul-2002; LatestRevisionNote: Re-released for DXP Platform.; PackageReference: PIN2; Publisher: Altium Limited
N1 N2 = 无引脚
P1 P2 = Header 2: Header, 2-Pin; LatestRevisionDate: 17-Jul-2002; LatestRevisionNote: Re-released for DXP Platform.; Publisher: Altium Limited
P3 = DC-007B
P4 = Header 6: Header, 6-Pin; LatestRevisionDate: 17-Jul-2002; LatestRevisionNote: Re-released for DXP Platform.; Publisher: Altium Limited
P5 P8 = Header 9: Header, 9-Pin; LatestRevisionDate: 17-Jul-2002; LatestRevisionNote: Re-released for DXP Platform.; Publisher: Altium Limited
P6 = Header 28: Header, 28-Pin; LatestRevisionDate: 17-Jul-2002; LatestRevisionNote: Re-released for DXP Platform.; Publisher: Altium Limited
P7 = Header 5: Header, 5-Pin; LatestRevisionDate: 17-Jul-2002; LatestRevisionNote: Re-released for DXP Platform.; Publisher: Altium Limited
P9 = USB-5_A
Q2 Q4 Q7 Q9 = S8550: PNP SOT-23; Published: 8-Jun-2000; LatestRevisionDate: 15-Jan-2003; LatestRevisionNote: PCB Footprint 'BCY-W3/D4.7' replaced; DatasheetVersion: 1997; PackageVersion: Sep-1998; PackageReference: TO-92A; Publisher: Altium Limited; Code_JEDEC: TO-92A; ComponentLink1Description: Manufacturer Link; ComponentLink1URL: http://www.fairchildsemi.com/; ComponentLink2Description: Datasheet; ComponentLink2URL: http://www.fairchildsemi.com/ds/2N%2F2N3906.pdf
R1-R23 R25 R30 R32 R34-R55 = Res2-0603: 0603; Published: 8-Jun-2000; LatestRevisionDate: 17-Jul-2002; LatestRevisionNote: Re-released for DXP Platform.; PackageReference: AXIAL-0.4; Publisher: Altium Limited
R24 R29 = Res2: Resistor; Published: 8-Jun-2000; LatestRevisionDate: 17-Jul-2002; LatestRevisionNote: Re-released for DXP Platform.; PackageReference: AXIAL-0.4; Publisher: Altium Limited
R26-R28 R31 R33 = Res2: Resistor; Value: 1K; Published: 8-Jun-2000; LatestRevisionDate: 17-Jul-2002; LatestRevisionNote: Re-released for DXP Platform.; PackageReference: AXIAL-0.4; Publisher: Altium Limited
s1 = TS-007: 五向开关
U1 = HLW8012: 单相多功能计量芯片
U2 = FR9833SPCTR: DC-DC降压
U3 U5 = ME6206A33M3G: LDO稳压 SOT-23
U4 = 78M05: TO-252
U6 = TL431: 稳压芯片 SOT-23
U9 = MAX3082: RS485总线转串口
U10 U12 U14 U15 = XTR111: 4-20ma输出
Y1 = 晶振